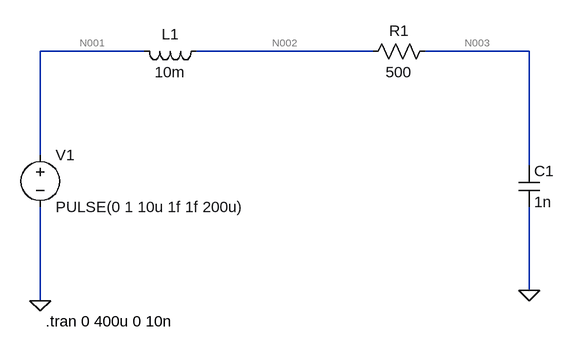
[diagram p0: schematic 3.asc]
3.asc, the LTspice schematic file:
Version 4
SHEET 1 880 680
WIRE 16 160 -144 160
WIRE 368 160 96 160
WIRE 608 160 448 160
WIRE -144 320 -144 160
WIRE 608 336 608 160
WIRE 608 528 608 400
WIRE -144 544 -144 400
FLAG -144 544 0
FLAG 608 528 0
SYMBOL ind 112 144 R90
WINDOW 0 5 56 VBottom 2
WINDOW 3 32 56 VTop 2
SYMATTR InstName L1
SYMATTR Value 10m
SYMBOL res 464 144 R90
WINDOW 0 0 56 VBottom 2
WINDOW 3 32 56 VTop 2
SYMATTR InstName R1
SYMATTR Value 500
SYMBOL cap 592 336 R0
SYMATTR InstName C1
SYMATTR Value 1n
SYMBOL voltage -144 304 R0
WINDOW 123 0 0 Left 0
WINDOW 39 0 0 Left 0
SYMATTR InstName V1
SYMATTR Value PULSE(0 1 10u 1f 1f 200u)
TEXT -136 576 Left 2 !.tran 0 400u 0 10n

The netlist it stands for:
* 3.asc
L1 N002 N001 10m
R1 N003 N002 500
C1 N003 0 1n
V1 N001 0 PULSE(0 1 10u 1f 1f 200u)
.tran 0 400u 0 10n
.backanno
.end

* Results of the author's LTspice run, read from the files saved beside the schematic
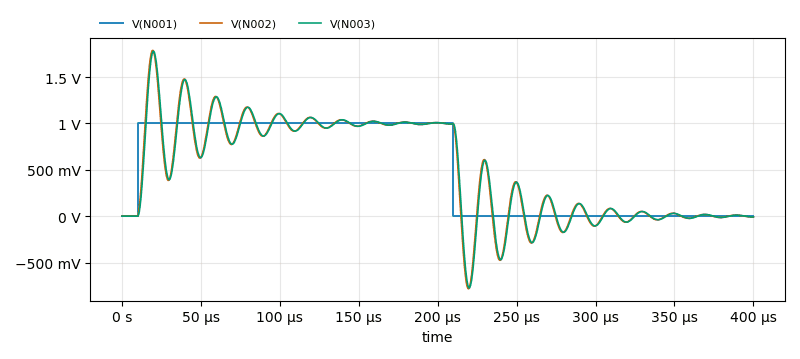
[diagram p1: Transient Analysis of 3.asc, plotted from the saved traces]
* Transient Analysis, 1 run:
*   V(N001): min 0 V, max 1 V, average 500 mV, rms 707.1 mV, last 0 V
*   V(N002): min -783.5 mV, max 1.788 V, average 500 mV, rms 741.5 mV, last -8.28 mV
*   V(N003): min -774.2 mV, max 1.779 V, average 500 mV, rms 740.7 mV, last -8.555 mV